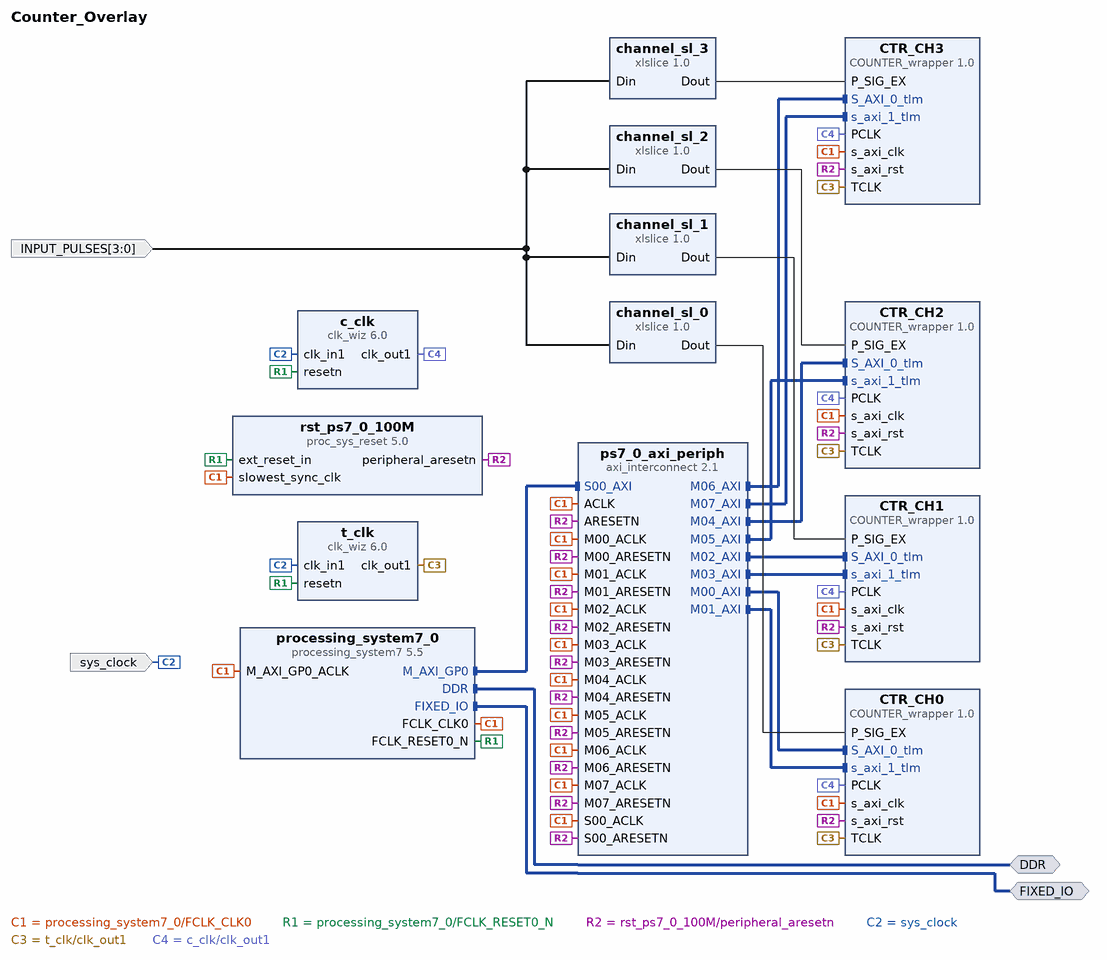
[diagram p0: block diagram of the top level]
# Vivado block design Counter_Overlay, xc7z020clg400-1, Vivado 2019.1
create_bd_design Counter_Overlay

create_bd_intf_port -mode Master -vlnv xilinx.com:interface:ddrx_rtl:1.0 DDR
create_bd_intf_port -mode Master -vlnv xilinx.com:display_processing_system7:fixedio_rtl:1.0 FIXED_IO
create_bd_port -dir I -type clk sys_clock
set_property -dict {CONFIG.FREQ_HZ 125000000 CONFIG.PHASE 0.000} [get_bd_ports sys_clock]
create_bd_port -dir I -from 3 -to 0 INPUT_PULSES

create_bd_cell -type ip -vlnv xilinx.com:ip:processing_system7:5.5 processing_system7_0
set_property -dict [list \
  CONFIG.PCW_APU_PERIPHERAL_FREQMHZ 650 \
  CONFIG.PCW_CRYSTAL_PERIPHERAL_FREQMHZ 50 \
  CONFIG.PCW_ENET0_ENET0_IO {MIO 16 .. 27} \
  CONFIG.PCW_ENET0_GRP_MDIO_ENABLE 1 \
  CONFIG.PCW_ENET0_GRP_MDIO_IO {MIO 52 .. 53} \
  CONFIG.PCW_ENET0_PERIPHERAL_ENABLE 1 \
  CONFIG.PCW_ENET0_RESET_ENABLE 1 \
  CONFIG.PCW_ENET0_RESET_IO {MIO 9} \
  CONFIG.PCW_ENET_RESET_ENABLE 1 \
  CONFIG.PCW_ENET_RESET_SELECT {Share reset pin} \
  CONFIG.PCW_FPGA0_PERIPHERAL_FREQMHZ 100 \
  CONFIG.PCW_FPGA1_PERIPHERAL_FREQMHZ 50 \
  CONFIG.PCW_GPIO_MIO_GPIO_ENABLE 1 \
  CONFIG.PCW_GPIO_MIO_GPIO_IO MIO \
  CONFIG.PCW_I2C_RESET_ENABLE 1 \
  CONFIG.PCW_M_AXI_GP0_FREQMHZ 10 \
  CONFIG.PCW_PERIPHERAL_BOARD_PRESET None \
  CONFIG.PCW_PRESET_BANK1_VOLTAGE {LVCMOS 1.8V} \
  CONFIG.PCW_QSPI_GRP_FBCLK_ENABLE 1 \
  CONFIG.PCW_QSPI_GRP_FBCLK_IO {MIO 8} \
  CONFIG.PCW_QSPI_GRP_SINGLE_SS_ENABLE 1 \
  CONFIG.PCW_QSPI_GRP_SINGLE_SS_IO {MIO 1 .. 6} \
  CONFIG.PCW_QSPI_PERIPHERAL_ENABLE 1 \
  CONFIG.PCW_QSPI_QSPI_IO {MIO 1 .. 6} \
  CONFIG.PCW_SD0_GRP_CD_ENABLE 1 \
  CONFIG.PCW_SD0_GRP_CD_IO {MIO 47} \
  CONFIG.PCW_SD0_GRP_WP_ENABLE 0 \
  CONFIG.PCW_SD0_PERIPHERAL_ENABLE 1 \
  CONFIG.PCW_SD0_SD0_IO {MIO 40 .. 45} \
  CONFIG.PCW_SDIO_PERIPHERAL_FREQMHZ 50 \
  CONFIG.PCW_SINGLE_QSPI_DATA_MODE x4 \
  CONFIG.PCW_UART0_PERIPHERAL_ENABLE 1 \
  CONFIG.PCW_UART0_UART0_IO {MIO 14 .. 15} \
  CONFIG.PCW_UART1_PERIPHERAL_ENABLE 0 \
  CONFIG.PCW_UART_PERIPHERAL_FREQMHZ 100 \
  CONFIG.PCW_UIPARAM_DDR_BUS_WIDTH {16 Bit} \
  CONFIG.PCW_UIPARAM_DDR_FREQ_MHZ 525 \
  CONFIG.PCW_UIPARAM_DDR_PARTNO {MT41J256M16 RE-125} \
  CONFIG.PCW_USB0_PERIPHERAL_ENABLE 1 \
  CONFIG.PCW_USB0_RESET_ENABLE 1 \
  CONFIG.PCW_USB0_RESET_IO {MIO 46} \
  CONFIG.PCW_USB0_USB0_IO {MIO 28 .. 39} \
  CONFIG.PCW_USB_RESET_ENABLE 1 \
  CONFIG.PCW_USB_RESET_SELECT {Share reset pin} \
] [get_bd_cells processing_system7_0]
# 481 more settings of processing_system7_0 are not shown: defaults, MIO pin electricals, DDR timing, and values the tool derives
create_bd_cell -type ip -vlnv xilinx.com:ip:axi_interconnect:2.1 ps7_0_axi_periph
set_property -dict {CONFIG.NUM_MI 8} [get_bd_cells ps7_0_axi_periph]
create_bd_cell -type ip -vlnv xilinx.com:ip:proc_sys_reset:5.0 rst_ps7_0_100M
create_bd_cell -type ip -vlnv xilinx.com:ip:clk_wiz:6.0 t_clk
set_property -dict [list \
  CONFIG.CLKOUT1_JITTER 119.348 \
  CONFIG.CLKOUT1_REQUESTED_OUT_FREQ 125.000 \
  CONFIG.CLK_IN1_BOARD_INTERFACE sys_clock \
  CONFIG.MMCM_CLKOUT0_DIVIDE_F 8.000 \
  CONFIG.RESET_PORT resetn \
  CONFIG.RESET_TYPE ACTIVE_LOW \
  CONFIG.USE_BOARD_FLOW true \
  CONFIG.USE_LOCKED false \
] [get_bd_cells t_clk]
create_bd_cell -type ip -vlnv xilinx.com:ip:clk_wiz:6.0 c_clk
set_property -dict [list \
  CONFIG.CLKIN1_JITTER_PS 80.0 \
  CONFIG.CLKOUT1_DRIVES BUFG \
  CONFIG.CLKOUT1_JITTER 109.241 \
  CONFIG.CLKOUT1_PHASE_ERROR 96.948 \
  CONFIG.CLKOUT1_REQUESTED_OUT_FREQ 200 \
  CONFIG.CLKOUT2_DRIVES BUFG \
  CONFIG.CLKOUT3_DRIVES BUFG \
  CONFIG.CLKOUT4_DRIVES BUFG \
  CONFIG.CLKOUT5_DRIVES BUFG \
  CONFIG.CLKOUT6_DRIVES BUFG \
  CONFIG.CLKOUT7_DRIVES BUFG \
  CONFIG.JITTER_SEL Min_O_Jitter \
  CONFIG.MMCM_BANDWIDTH HIGH \
  CONFIG.MMCM_CLKFBOUT_MULT_F 8 \
  CONFIG.MMCM_CLKIN1_PERIOD 8.000 \
  CONFIG.MMCM_CLKIN2_PERIOD 10.0 \
  CONFIG.MMCM_CLKOUT0_DIVIDE_F 5 \
  CONFIG.MMCM_COMPENSATION ZHOLD \
  CONFIG.MMCM_DIVCLK_DIVIDE 1 \
  CONFIG.PRIMITIVE PLL \
  CONFIG.PRIM_IN_FREQ 125.000 \
  CONFIG.RESET_PORT resetn \
  CONFIG.RESET_TYPE ACTIVE_LOW \
  CONFIG.USE_LOCKED false \
] [get_bd_cells c_clk]
create_bd_cell -type ip -vlnv xilinx.com:ip:xlslice:1.0 channel_sl_0
set_property -dict {CONFIG.DIN_FROM 0 CONFIG.DIN_TO 0 CONFIG.DIN_WIDTH 4} [get_bd_cells channel_sl_0]
create_bd_cell -type ip -vlnv xilinx.com:ip:xlslice:1.0 channel_sl_1
set_property -dict {CONFIG.DIN_FROM 1 CONFIG.DIN_TO 1 CONFIG.DIN_WIDTH 4} [get_bd_cells channel_sl_1]
create_bd_cell -type ip -vlnv xilinx.com:ip:xlslice:1.0 channel_sl_2
set_property -dict {CONFIG.DIN_FROM 2 CONFIG.DIN_TO 2 CONFIG.DIN_WIDTH 4 CONFIG.DOUT_WIDTH 1} [get_bd_cells channel_sl_2]
create_bd_cell -type ip -vlnv xilinx.com:ip:xlslice:1.0 channel_sl_3
set_property -dict {CONFIG.DIN_FROM 3 CONFIG.DIN_TO 3 CONFIG.DIN_WIDTH 4 CONFIG.DOUT_WIDTH 1} [get_bd_cells channel_sl_3]
create_bd_cell -type ip -vlnv xilinx.com:user:COUNTER_wrapper:1.0 CTR_CH0
create_bd_cell -type ip -vlnv xilinx.com:user:COUNTER_wrapper:1.0 CTR_CH1
create_bd_cell -type ip -vlnv xilinx.com:user:COUNTER_wrapper:1.0 CTR_CH2
create_bd_cell -type ip -vlnv xilinx.com:user:COUNTER_wrapper:1.0 CTR_CH3

# ---- connections ----

connect_bd_intf_net [get_bd_intf_ports DDR] [get_bd_intf_pins processing_system7_0/DDR]
connect_bd_intf_net [get_bd_intf_pins processing_system7_0/M_AXI_GP0] [get_bd_intf_pins ps7_0_axi_periph/S00_AXI]
connect_bd_intf_net [get_bd_intf_ports FIXED_IO] [get_bd_intf_pins processing_system7_0/FIXED_IO]
connect_bd_intf_net [get_bd_intf_pins ps7_0_axi_periph/M02_AXI] [get_bd_intf_pins CTR_CH1/S_AXI_0_tlm]
connect_bd_intf_net [get_bd_intf_pins ps7_0_axi_periph/M04_AXI] [get_bd_intf_pins CTR_CH2/S_AXI_0_tlm]
connect_bd_intf_net [get_bd_intf_pins ps7_0_axi_periph/M06_AXI] [get_bd_intf_pins CTR_CH3/S_AXI_0_tlm]
connect_bd_intf_net [get_bd_intf_pins ps7_0_axi_periph/M03_AXI] [get_bd_intf_pins CTR_CH1/s_axi_1_tlm]
connect_bd_intf_net [get_bd_intf_pins ps7_0_axi_periph/M05_AXI] [get_bd_intf_pins CTR_CH2/s_axi_1_tlm]
connect_bd_intf_net [get_bd_intf_pins ps7_0_axi_periph/M07_AXI] [get_bd_intf_pins CTR_CH3/s_axi_1_tlm]
connect_bd_intf_net [get_bd_intf_pins ps7_0_axi_periph/M00_AXI] [get_bd_intf_pins CTR_CH0/S_AXI_0_tlm]
connect_bd_intf_net [get_bd_intf_pins ps7_0_axi_periph/M01_AXI] [get_bd_intf_pins CTR_CH0/s_axi_1_tlm]
connect_bd_net [get_bd_pins processing_system7_0/FCLK_CLK0] \
  [get_bd_pins processing_system7_0/M_AXI_GP0_ACLK] [get_bd_pins ps7_0_axi_periph/S00_ACLK] \
  [get_bd_pins rst_ps7_0_100M/slowest_sync_clk] [get_bd_pins ps7_0_axi_periph/M00_ACLK] [get_bd_pins ps7_0_axi_periph/ACLK] \
  [get_bd_pins ps7_0_axi_periph/M01_ACLK] [get_bd_pins ps7_0_axi_periph/M02_ACLK] [get_bd_pins ps7_0_axi_periph/M03_ACLK] \
  [get_bd_pins ps7_0_axi_periph/M04_ACLK] [get_bd_pins ps7_0_axi_periph/M05_ACLK] [get_bd_pins ps7_0_axi_periph/M06_ACLK] \
  [get_bd_pins ps7_0_axi_periph/M07_ACLK] [get_bd_pins CTR_CH0/s_axi_clk] [get_bd_pins CTR_CH1/s_axi_clk] \
  [get_bd_pins CTR_CH2/s_axi_clk] [get_bd_pins CTR_CH3/s_axi_clk]
connect_bd_net [get_bd_pins processing_system7_0/FCLK_RESET0_N] \
  [get_bd_pins rst_ps7_0_100M/ext_reset_in] [get_bd_pins c_clk/resetn] [get_bd_pins t_clk/resetn]
connect_bd_net [get_bd_pins rst_ps7_0_100M/peripheral_aresetn] \
  [get_bd_pins ps7_0_axi_periph/S00_ARESETN] [get_bd_pins ps7_0_axi_periph/M00_ARESETN] \
  [get_bd_pins ps7_0_axi_periph/ARESETN] [get_bd_pins ps7_0_axi_periph/M01_ARESETN] \
  [get_bd_pins ps7_0_axi_periph/M02_ARESETN] [get_bd_pins ps7_0_axi_periph/M03_ARESETN] \
  [get_bd_pins ps7_0_axi_periph/M04_ARESETN] [get_bd_pins ps7_0_axi_periph/M05_ARESETN] \
  [get_bd_pins ps7_0_axi_periph/M06_ARESETN] [get_bd_pins ps7_0_axi_periph/M07_ARESETN] [get_bd_pins CTR_CH0/s_axi_rst] \
  [get_bd_pins CTR_CH1/s_axi_rst] [get_bd_pins CTR_CH2/s_axi_rst] [get_bd_pins CTR_CH3/s_axi_rst]
connect_bd_net [get_bd_ports sys_clock] [get_bd_pins t_clk/clk_in1] [get_bd_pins c_clk/clk_in1]
connect_bd_net [get_bd_ports INPUT_PULSES] \
  [get_bd_pins channel_sl_0/Din] [get_bd_pins channel_sl_1/Din] [get_bd_pins channel_sl_2/Din] [get_bd_pins channel_sl_3/Din]
connect_bd_net [get_bd_pins t_clk/clk_out1] \
  [get_bd_pins CTR_CH0/TCLK] [get_bd_pins CTR_CH1/TCLK] [get_bd_pins CTR_CH2/TCLK] [get_bd_pins CTR_CH3/TCLK]
connect_bd_net [get_bd_pins c_clk/clk_out1] \
  [get_bd_pins CTR_CH3/PCLK] [get_bd_pins CTR_CH2/PCLK] [get_bd_pins CTR_CH1/PCLK] [get_bd_pins CTR_CH0/PCLK]
connect_bd_net [get_bd_pins channel_sl_0/Dout] [get_bd_pins CTR_CH0/P_SIG_EX]
connect_bd_net [get_bd_pins channel_sl_1/Dout] [get_bd_pins CTR_CH1/P_SIG_EX]
connect_bd_net [get_bd_pins channel_sl_2/Dout] [get_bd_pins CTR_CH2/P_SIG_EX]
connect_bd_net [get_bd_pins channel_sl_3/Dout] [get_bd_pins CTR_CH3/P_SIG_EX]

# ---- address map ----
assign_bd_address -offset 0x43C00000 -range 64K -target_address_space [get_bd_addr_spaces processing_system7_0/Data] [get_bd_addr_segs CTR_CH0/S_AXI_0_tlm/reg0]
assign_bd_address -offset 0x43C10000 -range 64K -target_address_space [get_bd_addr_spaces processing_system7_0/Data] [get_bd_addr_segs CTR_CH0/s_axi_1_tlm/reg0]
assign_bd_address -offset 0x43C20000 -range 64K -target_address_space [get_bd_addr_spaces processing_system7_0/Data] [get_bd_addr_segs CTR_CH1/S_AXI_0_tlm/reg0]
assign_bd_address -offset 0x43C30000 -range 64K -target_address_space [get_bd_addr_spaces processing_system7_0/Data] [get_bd_addr_segs CTR_CH1/s_axi_1_tlm/reg0]
assign_bd_address -offset 0x43C40000 -range 64K -target_address_space [get_bd_addr_spaces processing_system7_0/Data] [get_bd_addr_segs CTR_CH2/S_AXI_0_tlm/reg0]
assign_bd_address -offset 0x43C50000 -range 64K -target_address_space [get_bd_addr_spaces processing_system7_0/Data] [get_bd_addr_segs CTR_CH2/s_axi_1_tlm/reg0]
assign_bd_address -offset 0x43C60000 -range 64K -target_address_space [get_bd_addr_spaces processing_system7_0/Data] [get_bd_addr_segs CTR_CH3/S_AXI_0_tlm/reg0]
assign_bd_address -offset 0x43C70000 -range 64K -target_address_space [get_bd_addr_spaces processing_system7_0/Data] [get_bd_addr_segs CTR_CH3/s_axi_1_tlm/reg0]

validate_bd_design
save_bd_design
